# EAGLE design echofx (EAGLE 6.6.0)
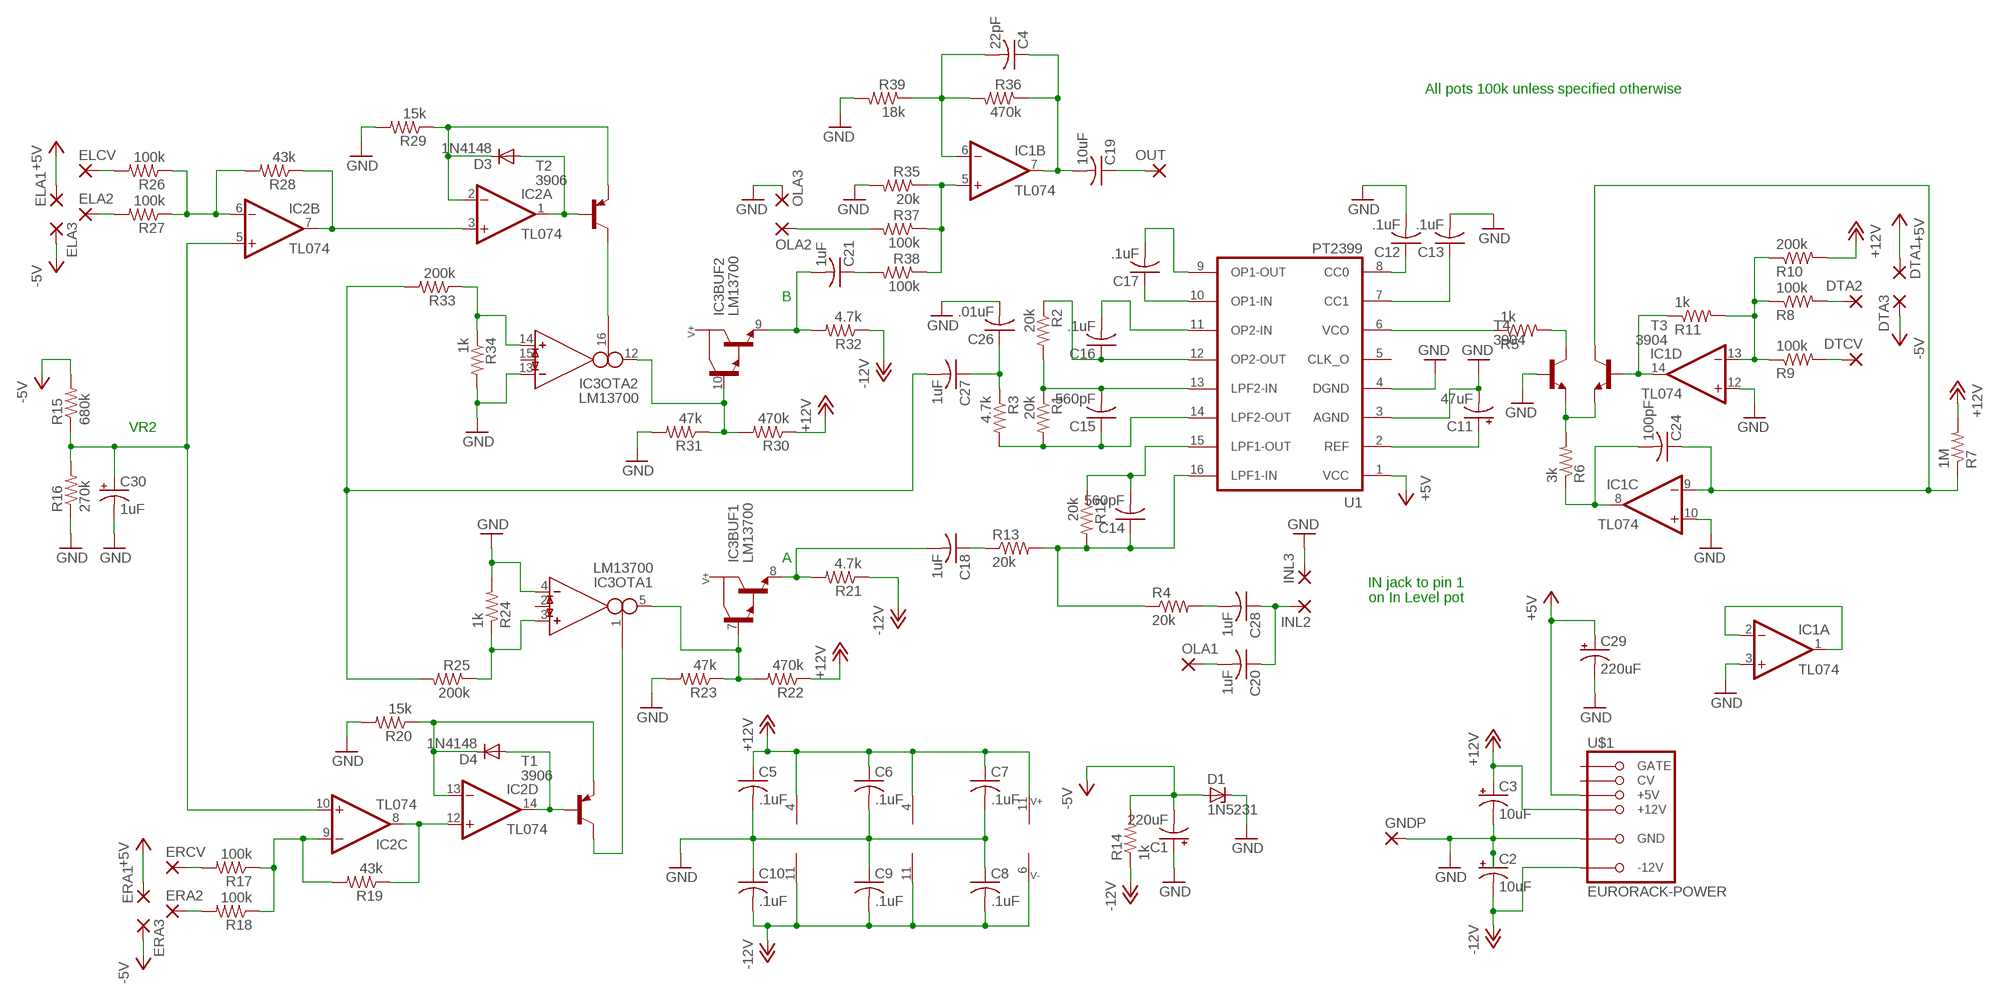
[diagram p0: schematic, sheet 1]

## Parts
C1  220uF  CPOL-USE2-5  [E2-5]
C2  10uF  CPOL-USE2-5  [E2-5]
C3  10uF  CPOL-USE2-5  [E2-5]
C4  22pF  C-US050-025X075  [C050-025X075]
C5  .1uF  C-US050-025X075  [C050-025X075]
C6  .1uF  C-US050-025X075  [C050-025X075]
C7  .1uF  C-US050-025X075  [C050-025X075]
C8  .1uF  C-US050-025X075  [C050-025X075]
C9  .1uF  C-US050-025X075  [C050-025X075]
C10  .1uF  C-US050-025X075  [C050-025X075]
C11  47uF  CPOL-USE2-5  [E2-5]
C12  .1uF  C-US050-025X075  [C050-025X075]
C13  .1uF  C-US050-025X075  [C050-025X075]
C14  560pF  C-US050-025X075  [C050-025X075]
C15  560pF  C-US050-025X075  [C050-025X075]
C16  .1uF  C-US050-025X075  [C050-025X075]
C17  .1uF  C-US050-025X075  [C050-025X075]
C18  1uF  C-US050-025X075  [C050-025X075]
C19  10uF  C-US050-025X075  [C050-025X075]
C20  1uF  C-US050-025X075  [C050-025X075]
C21  1uF  C-US050-025X075  [C050-025X075]
C24  100pF  C-US050-025X075  [C050-025X075]
C26  .01uF  C-US050-025X075  [C050-025X075]
C27  1uF  C-US050-025X075  [C050-025X075]
C28  1uF  C-US050-025X075  [C050-025X075]
C29  220uF  CPOL-USE2-5  [E2-5]
C30  1uF  CPOL-USE2-5  [E2-5]
D1  1N5231  ZENER-DIODEDO34-7  [DO34Z7]
D3  1N4148  1N4148DO35-7  [DO35-7]
D4  1N4148  1N4148DO35-7  [DO35-7]
DTA1  2,54/1,0  [2,54/1,0]
DTA2  2,54/1,0  [2,54/1,0]
DTA3  2,54/1,0  [2,54/1,0]
DTCV  2,54/1,0  [2,54/1,0]
ELA1  2,54/1,0  [2,54/1,0]
ELA2  2,54/1,0  [2,54/1,0]
ELA3  2,54/1,0  [2,54/1,0]
ELCV  2,54/1,0  [2,54/1,0]
ERA1  2,54/1,0  [2,54/1,0]
ERA2  2,54/1,0  [2,54/1,0]
ERA3  2,54/1,0  [2,54/1,0]
ERCV  2,54/1,0  [2,54/1,0]
GNDP  2,54/1,0  [2,54/1,0]
IC1  TL074  TL074-TOPP  [DIL14]
IC2  TL074  TL074-TOPP  [DIL14]
IC3  LM13700  LM13700N  [DIL16]
INL2  2,54/1,0  [2,54/1,0]
INL3  2,54/1,0  [2,54/1,0]
OLA1  2,54/1,0  [2,54/1,0]
OLA2  2,54/1,0  [2,54/1,0]
OLA3  2,54/1,0  [2,54/1,0]
OUT  2,54/1,0  [2,54/1,0]
R1  20k  R-US_0207/10  [0207/10]
R2  20k  R-US_0207/10  [0207/10]
R3  4.7k  R-US_0207/10  [0207/10]
R4  20k  R-US_0207/10  [0207/10]
R5  1k  R-US_0207/10  [0207/10]
R6  3k  R-US_0207/10  [0207/10]
R7  1M  R-US_0207/10  [0207/10]
R8  100k  R-US_0207/10  [0207/10]
R9  100k  R-US_0207/10  [0207/10]
R10  200k  R-US_0207/10  [0207/10]
R11  1k  R-US_0207/10  [0207/10]
R12  20k  R-US_0207/10  [0207/10]
R13  20k  R-US_0207/10  [0207/10]
R14  1k  R-US_0207/10  [0207/10]
R15  680k  R-US_0207/10  [0207/10]
R16  270k  R-US_0207/10  [0207/10]
R17  100k  R-US_0207/10  [0207/10]
R18  100k  R-US_0207/10  [0207/10]
R19  43k  R-US_0207/10  [0207/10]
R20  15k  R-US_0207/10  [0207/10]
R21  4.7k  R-US_0207/10  [0207/10]
R22  470k  R-US_0207/10  [0207/10]
R23  47k  R-US_0207/10  [0207/10]
R24  1k  R-US_0207/10  [0207/10]
R25  200k  R-US_0207/10  [0207/10]
R26  100k  R-US_0207/10  [0207/10]
R27  100k  R-US_0207/10  [0207/10]
R28  43k  R-US_0207/10  [0207/10]
R29  15k  R-US_0207/10  [0207/10]
R30  470k  R-US_0207/10  [0207/10]
R31  47k  R-US_0207/10  [0207/10]
R32  4.7k  R-US_0207/10  [0207/10]
R33  200k  R-US_0207/10  [0207/10]
R34  1k  R-US_0207/10  [0207/10]
R35  20k  R-US_0207/10  [0207/10]
R36  470k  R-US_0207/10  [0207/10]
R37  100k  R-US_0207/10  [0207/10]
R38  100k  R-US_0207/10  [0207/10]
R39  18k  R-US_0207/10  [0207/10]
T1  3906  2N3906-PNP-TO92-EBC  [TO92-EBC]
T2  3906  2N3906-PNP-TO92-EBC  [TO92-EBC]
T3  3904  2N3904-NPN-TO92-EBC  [TO92-EBC]
T4  3904  2N3904-NPN-TO92-EBC  [TO92-EBC]
U1  PT2399  [DIL16]
U$1  EURORACK-POWER  [PINSHRD_PTH_2X8]

## Nets
+5V: C29.+ DTA1.1(P) ELA1.1(P) ERA1.1(P) U1.1(VCC) U$1.+5V@1(+5V) U$1.+5V@2(+5V)
+12V: C3.+ C5.1 C6.1 C7.1 IC1.4(P:V+) IC2.4(P:V+) IC3.11 R7.2 R10.2 R22.1 R30.1 U$1.+12V@1(+12V) U$1.+12V@2(+12V)
-5V: C1.- D1.A DTA3.1(P) ELA3.1(P) ERA3.1(P) R14.2 R15.2
-12V: C2.- C8.2 C9.2 C10.2 IC1.11(P:V-) IC2.11(P:V-) IC3.6 R14.1 R21.1 R32.1 U$1.-12V@1(-12V) U$1.-12V@2(-12V)
GND: C1.+ C2.+ C3.- C5.2 C6.2 C7.2 C8.1 C9.1 C10.1 C11.- C12.2 C13.2 C26.2 C29.- C30.- D1.C GNDP.1(P) IC1.3(A:+IN) IC1.10(C:+IN) IC1.12(D:+IN) IC3.4(OTA1:IN_N) IC3.13(OTA2:IN_N) INL3.1(P) OLA3.1(P) R16.1 R20.2 R23.2 R24.2 R29.2 R31.2 R34.2 R35.2 R39.2 T4.B U1.3(AGND) U1.4(DGND) U$1.GND@1(GND) U$1.GND@2(GND) U$1.GND@3(GND) U$1.GND@4(GND) U$1.GND@5(GND) U$1.GND@6(GND)
N$1: C11.+ U1.2(REF)
N$2: IC1.14(D:OUT) R11.1 T3.B
N$3: C12.1 U1.8(CC0)
N$4: C13.1 U1.7(CC1)
N$5: C17.1 U1.10(OP1-IN)
N$6: C17.2 U1.9(OP1-OUT)
N$7: C16.2 U1.11(OP2-IN)
N$8: C16.1 R2.1 U1.12(OP2-OUT)
N$9: C15.2 R1.1 R2.2 U1.13(LPF2-IN)
N$10: C15.1 R1.2 R3.2 U1.14(LPF2-OUT)
N$11: C26.1 C27.1 R3.1
N$12: C20.1 C28.1 INL2.1(P)
N$13: C28.2 R4.2
N$14: R5.1 U1.6(VCO)
N$15: C24.1 IC1.9(C:-IN) R7.1 T3.C
N$16: C24.2 IC1.8(C:OUT) R6.1
N$17: R6.2 T3.E T4.E
N$18: R5.2 T4.C
N$19: DTA2.1(P) R8.2
N$20: DTCV.1(P) R9.2
N$21: IC1.13(D:-IN) R8.1 R9.1 R10.1 R11.2
N$22: C14.2 R12.1 U1.15(LPF1-OUT)
N$23: C14.1 R4.1 R12.2 R13.2 U1.16(LPF1-IN)
N$24: C18.1 R13.1
N$25: ERCV.1(P) R17.2
N$26: C27.2 R25.2 R33.2
N$27: ERA2.1(P) R18.2
N$28: IC2.9(C:-IN) R17.1 R18.1 R19.2
N$29: IC2.8(C:OUT) IC2.12(D:+IN) R19.1
N$30: D4.C IC2.13(D:-IN) R20.1 T1.E
N$31: D4.A IC2.14(D:OUT) T1.B
N$32: C18.2 IC3.8(BUF1:E) R21.2
N$33: IC3.1(OTA1:I_BIAS) T1.C
N$34: IC3.5(OTA1:OUT) IC3.7(BUF1:B) R22.2 R23.1
N$35: IC3.3(OTA1:IN_P) R24.1 R25.1
N$36: ELCV.1(P) R26.2
N$37: ELA2.1(P) R27.2
N$38: IC2.6(B:-IN) R26.1 R27.1 R28.2
N$39: IC2.3(A:+IN) IC2.7(B:OUT) R28.1
N$40: D3.C IC2.2(A:-IN) R29.1 T2.E
N$41: D3.A IC2.1(A:OUT) T2.B
N$42: IC3.16(OTA2:I_BIAS) T2.C
N$43: IC3.10(BUF2:B) IC3.12(OTA2:OUT) R30.2 R31.1
N$44: C21.2 IC3.9(BUF2:E) R32.2
N$45: IC3.14(OTA2:IN_P) R33.1 R34.1
N$46: IC1.5(B:+IN) R35.1 R37.1 R38.1
N$47: C30.+ IC2.5(B:+IN) IC2.10(C:+IN) R15.1 R16.2
N$48: C4.2 IC1.6(B:-IN) R36.2 R39.1
N$49: C4.1 C19.2 IC1.7(B:OUT) R36.1
N$50: C19.1 OUT.1(P)
N$51: OLA2.1(P) R37.2
N$52: C20.2 OLA1.1(P)
N$53: C21.1 R38.2
N$55: IC1.1(A:OUT) IC1.2(A:-IN)
Unconnected: IC3.2(OTA1:I_DIODE) IC3.15(OTA2:I_DIODE) U1.5(CLK_O) U$1.CV@1(CV) U$1.CV@2(CV) U$1.GATE@1(GATE) U$1.GATE@2(GATE)

## Notes on the sheet
- All pots 100k unless specified otherwise
- B
- VR2
- A
- IN jack to pin 1
  on In Level pot

## Library data of the parts
C1-C3 C11 C29 C30 = rcl:CPOL-US: POLARIZED CAPACITOR, American symbol
C4-C10 C12-C21 C24 C26-C28 = rcl:C-US: CAPACITOR, American symbol
D1 = diode:ZENER-DIODE: Z-Diode
D3 D4 = diode:1N4148: DIODE high speed (Philips)
DTA1-DTA3 DTCV ELA1-ELA3 ELCV ERA1-ERA3 ERCV GNDP INL2 INL3 OLA1-OLA3 OUT = wirepad:2,54/1,0: THROUGH-HOLE PAD
IC1 IC2 = mmoretti:TL074-TOP: OP AMP
IC3 = mmoretti:LM13700: Dual OTA with buffers
R1-R39 = rcl:R-US_: RESISTOR, American symbol
T1 T2 = transistor-neu-to92:*-PNP-: PNP Transistror
T3 T4 = transistor-neu-to92:*-NPN-: NPN Transistror
U1 = mmoretti:PT2399: Echo Processor IC
U$1 = mmoretti:EURORACK-POWER

## Board
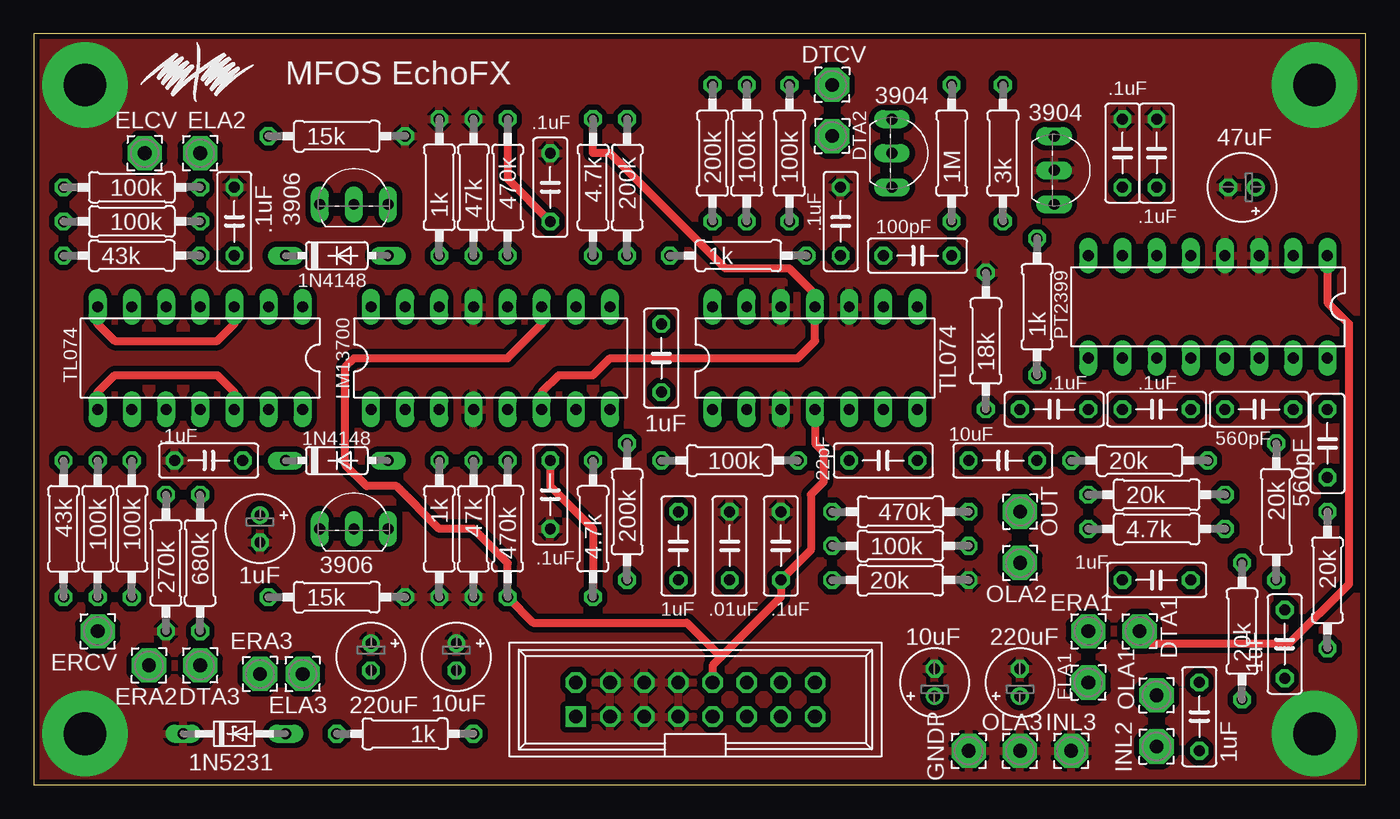
[diagram p1: board, top side]
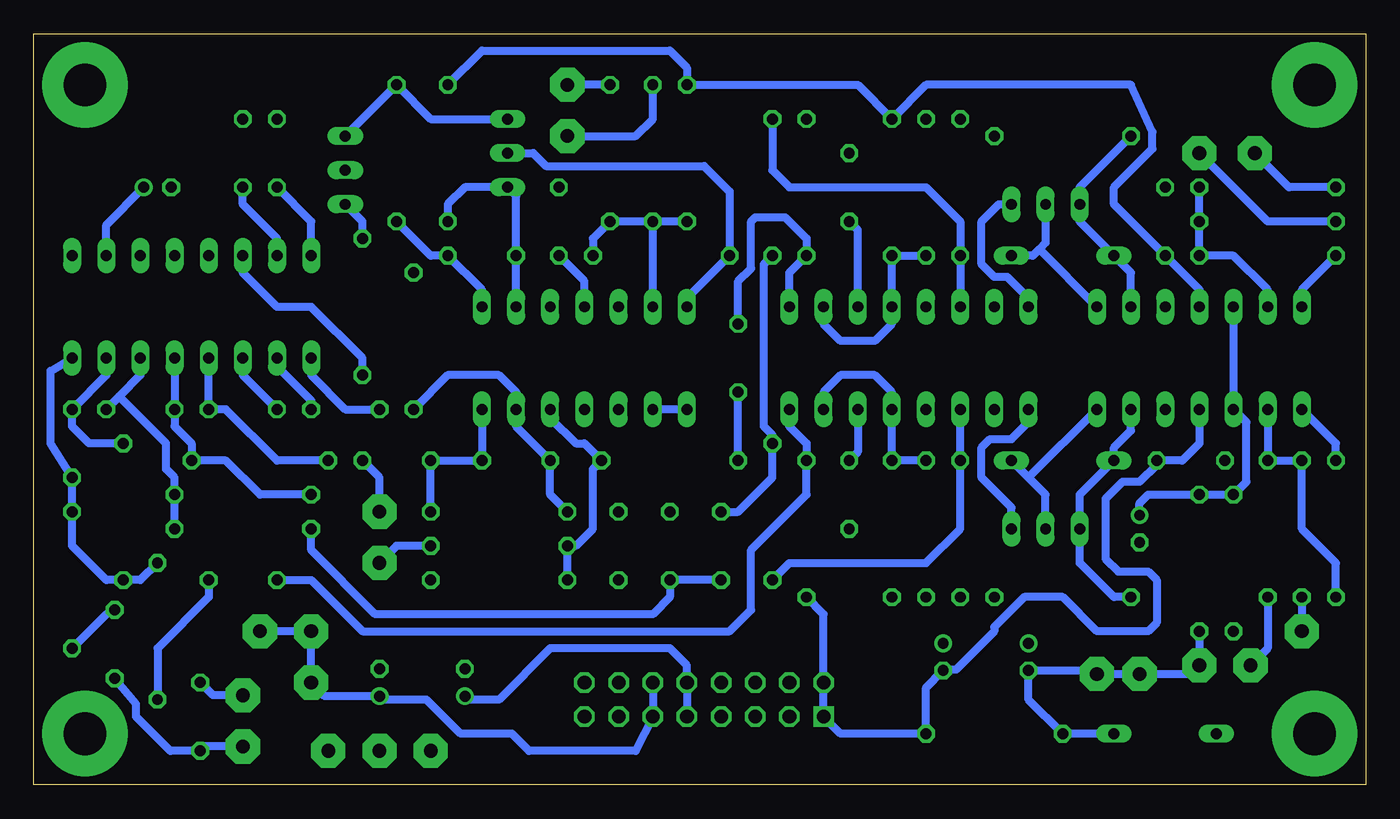
[diagram p2: board, bottom side, seen from below]

Size 99.06 x 55.88 mm. Coordinates in mm from the lower left corner, seen from the top.
Outline: 0,0 99.04,0 99.06,55.88 0,55.88 0,0
Copper layers (1*16): Top 0.035mm / dielectric 1.5mm / Bottom 0.035mm
Design rules "SeeedStudio_2layer_DRU_no_angle_20140221": minimum track width 6mil, minimum drill 12mil, track to track 6mil, track to pad 6mil, pad to pad 6mil, via to via 6mil, smd to smd 0mil, copper to edge 10mil, drill to drill 10mil, minimum pad ring 10mil, minimum via ring 6mil, stop-mask expansion 2mil, vias tented up to drill 100mil, thermal gap 10mil

### Footprints (pad centres in the part's own frame; a part is rotated, then mirrored left to right if it is on the bottom)
E2-5 = drill 0.813 pad 1.27: + -1.016,0 | drill 0.813 pad 1.27 octagon: - 1.016,0
C050-025X075 = drill 0.813 octagon: 1 -2.54,0; 2 2.54,0
DO34Z7 = drill 0.813 long: A 3.81,0; C -3.81,0
DO35-7 = drill 0.813 long: A 3.81,0; C -3.81,0
2,54/1,0 = drill 1.016 pad 2.54 octagon: 1 0,0
DIL14 = drill 0.813 long: 1 -7.62,-3.81; 2 -5.08,-3.81; 3 -2.54,-3.81; 4 0,-3.81; 5 2.54,-3.81; 6 5.08,-3.81; 7 7.62,-3.81; 8 7.62,3.81; 9 5.08,3.81; 10 2.54,3.81; 11 0,3.81; 12 -2.54,3.81; 13 -5.08,3.81; 14 -7.62,3.81
DIL16 = drill 0.813 long: 1 -8.89,-3.81; 2 -6.35,-3.81; 3 -3.81,-3.81; 4 -1.27,-3.81; 5 1.27,-3.81; 6 3.81,-3.81; 7 6.35,-3.81; 8 8.89,-3.81; 9 8.89,3.81; 10 6.35,3.81; 11 3.81,3.81; 12 1.27,3.81; 13 -1.27,3.81; 14 -3.81,3.81; 15 -6.35,3.81; 16 -8.89,3.81
0207/10 = drill 0.813 octagon: 1 -5.08,0; 2 5.08,0
TO92-EBC = drill 0.813 long: B 0,-1.27; C 2.54,-1.27; E -2.54,-1.27
PINSHRD_PTH_2X8 = drill 1.016 octagon: +5V@1 3.81,1.27; +5V@2 3.81,-1.27; +12V@1 1.27,1.27; +12V@2 1.27,-1.27; -12V@1 -8.89,1.27; CV@1 6.35,1.27; CV@2 6.35,-1.27; GATE@1 8.89,1.27; GATE@2 8.89,-1.27; GND@1 -6.35,1.27; GND@2 -6.35,-1.27; GND@3 -3.81,1.27; GND@4 -3.81,-1.27; GND@5 -1.27,1.27; GND@6 -1.27,-1.27 | drill 1.016 square: -12V@2 -8.89,-1.27

### Placement (x,y rotation side)
C1  25.08,9.53 270 top
C2  31.43,9.53 270 top
C3  66.99,7.62 90 top
C4  63.18,24.13 180 top
C5  55.56,17.78 90 top
C6  14.92,41.91 90 top
C7  38.42,44.45 90 top
C8  38.42,21.59 90 top
C9  13.02,24.13 0 top
C10  60.01,41.91 270 top
C11  89.85,44.45 180 top
C12  80.96,46.99 90 top
C13  83.5,46.99 90 top
C14  96.2,25.4 90 top
C15  91.12,27.94 180 top
C16  83.5,27.94 180 top
C17  75.88,27.94 180 top
C18  83.5,15.24 180 top
C19  72.07,24.13 180 top
C20  86.68,5.08 90 top
C21  46.67,31.75 90 top
C24  65.72,39.37 0 top
C26  51.75,17.78 90 top
C27  47.94,17.78 90 top
C28  93.03,10.48 90 top
C29  73.34,7.62 90 top
C30  16.83,19.05 270 top
D1  14.92,3.81 0 top
D3  22.54,39.37 0 top
D4  22.54,24.13 0 top
DTA1  82.23,11.43 270 top
DTA2  59.37,48.26 180 top
DTA3  12.38,8.89 270 top
DTCV  59.37,52.07 180 top
ELA1  78.42,7.62 270 top
ELA2  12.38,46.99 0 top
ELA3  20,8.26 270 top
ELCV  8.26,46.99 0 top
ERA1  78.42,11.43 270 top
ERA2  8.57,8.89 0 top
ERA3  16.83,8.26 270 top
ERCV  4.76,11.43 0 top
GNDP  69.53,2.54 0 top
IC1  58.1,31.75 0 top
IC2  12.38,31.75 180 top
IC3  33.97,31.75 0 top
INL2  83.5,2.86 90 top
INL3  77.15,2.54 0 top
OLA1  83.5,6.67 90 top
OLA2  73.34,16.51 270 top
OLA3  73.34,2.54 0 top
OUT  73.34,20.32 270 top
R1  83.5,21.59 0 top
R2  82.23,24.13 0 top
R3  83.5,19.05 0 top
R4  96.2,15.24 270 top
R5  74.61,35.56 90 top
R6  72.07,46.99 90 top
R7  68.26,46.99 90 top
R8  53.02,46.99 90 top
R9  56.2,46.99 90 top
R10  50.48,46.99 90 top
R11  52.39,39.37 0 top
R12  92.39,20.32 270 top
R13  89.85,11.43 90 top
R14  27.62,3.81 180 top
R15  12.38,16.51 270 top
R16  9.84,16.51 90 top
R17  4.76,19.05 270 top
R18  7.3,19.05 270 top
R19  2.22,19.05 270 top
R20  22.54,13.97 0 top
R21  41.59,19.05 90 top
R22  35.24,19.05 90 top
R23  32.7,19.05 270 top
R24  30.16,19.05 270 top
R25  44.13,20.32 90 top
R26  7.3,44.45 180 top
R27  7.3,41.91 180 top
R28  7.3,39.37 0 top
R29  22.54,48.26 0 top
R30  35.24,44.45 270 top
R31  32.7,44.45 90 top
R32  41.59,44.45 270 top
R33  44.13,44.45 270 top
R34  30.16,44.45 90 top
R35  64.45,15.24 0 top
R36  64.45,20.32 180 top
R37  64.45,17.78 0 top
R38  51.75,24.13 180 top
R39  70.8,33.02 90 top
T1  23.81,20.32 0 top
T2  23.81,44.45 0 top
T3  65.09,46.99 270 top
T4  77.15,45.72 270 top
U1  87.31,35.56 180 top
U$1  49.21,6.35 0 top

### Tracks (layer width: path | path; a pad name or v marks a point on that pad's centre or on a via)
+5V
  Top 0.61: U1.1 96.2,35.88 97.79,34.29 97.79,14.92 93.34,10.48 83.19,10.48 DTA1.1
  Bottom 0.61: U$1.+5V@1 U$1.+5V@2 54.29,2.54 62.23,2.54 63.5,3.81 67.31,3.81 69.85,6.35 73.09,6.35 C29.+ 77.41,6.6 ELA1.1 ERA1.1 DTA1.1
+12V
  Top 0.61: IC1.4 58.1,25.4 58.74,24.77 58.74,22.54 57.78,21.59 57.78,17.46 C5.1 55.56,13.97 51.12,9.53 | 51.12,9.53 50.48,8.89 U$1.+12V@1 | R30.1 35.24,45.09 C7.1 | IC3.11 37.78,34.29 35.24,31.75 23.81,31.75 23.18,31.11 23.18,23.81 24.77,22.23 26.99,22.23 30.16,19.05 32.7,19.05 35.24,16.51 R22.1 37.15,12.06 48.58,12.06 51.12,9.53
  Bottom 0.61: R7.2 65.72,54.61 51.75,54.61 50.48,53.34 R10.2 37.78,52.07 R30.1 32.7,52.07 17.46,52.07 15.88,48.58 15.88,47.31 18.73,44.45 18.73,43.18 C6.1 12.38,36.83 IC2.4 | IC3.11 37.78,41.27 C7.1 | U$1.+12V@2 U$1.+12V@1 50.48,8.89 51.75,10.16 60.64,10.16 64.45,6.35 66.74,6.35 C3.+
-5V
  Bottom 0.61: R15.2 DTA3.1 13.02,8.26 ERA3.1 ELA3.1 20.26,8.51 C1.- 25.08,6.35 R14.2 D1.A
-12V
  Top 0.61: R32.1 41.59,46.99 42.86,46.99 51.44,38.42 56.2,38.42 58.1,36.51 IC1.11 58.1,33.02 56.83,31.75 42.86,31.75 41.59,30.48 39.05,30.48 37.78,29.21 IC3.6 | C8.2 38.42,22.23 41.59,19.05 R21.1
  Bottom 0.61: IC2.11 12.38,25.4 13.65,24.13 C9.2 15.56,23.81 16.83,22.54 18.1,22.54 19.37,21.27 19.37,16.83 18.41,15.88 16.19,15.88 15.56,15.24 15.56,12.06 16.19,11.43 20,11.43 22.54,13.97 25.4,13.97 27.62,11.75 27.62,11.43 30.48,8.57 31.37,8.57 C2.- 32.7,7.24 R14.1 39.05,3.81 U$1.-12V@2 U$1.-12V@1 40.32,12.7 R21.1 | IC3.6 37.78,24.77 C8.2 | IC1.11 58.1,37.47 C10.2
GND  (via drill 3.17 pad 6.35)
  other vias: 3.81,52.07 3.81,3.81 95.25,3.81 95.25,52.07
  pour Top (isolate 0.406): 0,55.88 99.06,55.88 99.06,0 0,0
N$1
  Bottom 0.61: U1.2 93.66,41.66 C11.+
N$2
  Bottom 0.61: T3.B 61.91,46.99 60.96,46.04 49.21,46.04 47.31,44.13 R11.1 50.48,36.2 IC1.14
N$3
  Bottom 0.61: U1.8 78.42,41.91 C12.1
N$4
  Bottom 0.61: U1.7 80.96,40.64 83.5,43.18 C13.1
N$5
  Bottom 0.61: U1.10 80.96,31.11 78.42,28.57 C17.1
N$6
  Bottom 0.61: U1.9 78.42,30.48 75.88,27.94 C17.2
N$7
  Bottom 0.61: U1.11 83.5,30.48 C16.2
N$8
  Bottom 0.61: R2.1 80.96,24.13 84.77,27.94 C16.1 U1.12
N$9
  Bottom 0.61: U1.13 C15.2 88.58,26.67 87.31,25.4 R2.2 84.77,24.13 82.23,21.59 R1.1
N$10
  Bottom 0.61: U1.14 91.12,30.48 92.71,28.89 | 92.71,28.89 C15.1 | R3.2 R1.2 88.58,22.86 89.22,23.5 89.22,25.4 92.71,28.89
N$11
  Bottom 0.61: C27.1 C26.1 51.75,13.97 53.02,12.7 73.66,12.7 78.42,17.46 R3.1
N$12
  Bottom 0.61: INL2.1 86.36,2.86 C20.1 88.9,2.54 91.44,5.08 91.44,6.03 C28.1
N$13
  Bottom 0.61: C28.2 93.66,12.7 R4.2
N$14
  Bottom 0.61: R5.1 74.61,31.75 78.42,35.56 80.96,35.56 83.5,38.1 U1.6
N$15
  Bottom 0.61: IC1.9 C24.1 63.18,43.81 T3.C 66.99,44.45 68.26,43.18 R7.1
N$16
  Bottom 0.61: IC1.8 65.72,36.83 C24.2 69.53,39.37 R6.1
N$17
  Bottom 0.61: T4.E R6.2 69.53,49.53 T3.E
N$18
  Bottom 0.61: R5.2 74.61,41.91 T4.C
N$19
  Bottom 0.61: DTA2.1 54.29,48.26 53.02,49.53 R8.2
N$20
  Bottom 0.61: R9.2 DTCV.1
N$21
  Bottom 0.61: IC1.13 R8.1 | R10.1 R8.1 | R8.1 R9.1 57.47,40.64 R11.2
N$22
  Bottom 0.61: U1.15 93.66,30.48 C14.2 96.2,26.67 94.93,25.4 R12.1
N$23
  Bottom 0.61: R13.2 91.12,15.24 R12.2 93.66,15.24 96.2,17.78 R4.1 C14.1 97.79,25.4 97.79,30.8 U1.16
N$24
  Bottom 0.61: C18.1 86.04,13.97 89.85,10.16 R13.1
N$25
  Bottom 0.61: R17.2 ERCV.1
N$26
  Bottom 0.61: R33.2 44.77,38.73 44.77,26.67 44.13,26.04 R25.2 44.13,22.86 46.67,20.32 C27.2
N$27
  Bottom 0.61: R18.2 7.3,10.16 ERA2.1
N$28
  Bottom 0.61: IC2.9 R18.1 R17.1 4.76,19.05 2.22,16.51 R19.2
N$29
  Top 0.61: IC2.8 4.76,29.21 6.03,30.48 13.65,30.48 14.92,29.21 IC2.12
  Bottom 0.61: R19.1 2.22,25.4 IC2.8
N$30
  Bottom 0.61: R20.1 18.73,13.97 21.27,16.51 T1.E 21.27,21.59 D4.C 18.73,25.08 17.46,26.35 IC2.13
N$31
  Bottom 0.61: T1.B 23.81,21.59 25.08,22.86 | 25.08,22.86 D4.A | IC2.14 25.08,22.86
N$32
  Bottom 0.61: IC3.8 42.86,26.67 41.59,25.4 R21.2 41.59,21.59 45.72,17.46 45.72,13.02 47.31,11.43 74.61,11.43 78.42,15.24 C18.2
N$33
  Bottom 0.61: T1.C 26.35,20.64 28.57,22.86 28.57,25.08 27.94,25.72 26.35,25.72 25.08,26.99 IC3.1
N$34
  Bottom 0.61: R23.1 R22.2 IC3.5 35.24,29.21 36.51,30.48 39.05,30.48 40.32,29.21 IC3.7
N$35
  Bottom 0.61: IC3.3 R24.1 30.16,19.05 32.7,16.51 42.86,16.51 R25.1
N$36
  Bottom 0.61: R26.2 5.71,44.45 ELCV.1
N$37
  Bottom 0.61: R27.2 7.3,41.91 ELA2.1
N$38
  Bottom 0.61: IC2.6 7.3,36.83 9.84,39.37 R28.2 R27.1 R26.1
N$39
  Top 0.61: IC2.7 4.76,34.29 6.03,33.02 13.65,33.02 14.92,34.29 IC2.3
  Bottom 0.61: IC2.7 4.76,36.83 R28.1
N$40
  Bottom 0.61: IC2.2 17.46,38.1 D3.C 21.27,41.91 T2.E 21.27,44.45 R29.1
N$41
  Bottom 0.61: T2.B 23.81,40.32 24.29,39.85 | 24.29,39.85 24.77,39.37 D3.A | IC2.1 24.29,39.85
N$42
  Bottom 0.61: IC3.16 25.08,36.2 26.67,37.78 27.62,37.78 28.57,38.73 28.57,41.91 27.3,43.18 T2.C
N$43
  Bottom 0.61: IC3.10 40.32,34.29 39.05,33.02 36.51,33.02 35.24,34.29 IC3.12 R30.2 R31.1
N$44
  Bottom 0.61: C21.2 46.67,37.47 45.72,38.42 45.72,41.91 45.4,42.23 43.18,42.23 41.59,40.64 R32.2 42.86,38.1 IC3.9
N$45
  Bottom 0.61: R33.1 44.13,45.72 42.86,44.45 32.7,44.45 30.16,41.91 R34.1 IC3.14
N$46
  Bottom 0.61: R35.1 R37.1 58.74,17.78 57.47,19.05 57.47,23.5 R38.1 58.1,25.4 58.74,25.4 60.64,27.3 IC1.5
N$47
  Bottom 0.61: C30.+ 16.83,20.95 16.19,21.59 R15.1 R16.2 8.89,22.54 8.89,26.99 IC2.10 IC2.5
N$48
  Bottom 0.61: R39.1 68.26,30.48 64.45,30.48 63.18,29.21 IC1.6 63.18,26.67 C4.2 60.64,21.59 R36.2
N$49
  Bottom 0.61: IC1.7 C4.1 C19.2 R36.1
N$50
  Bottom 0.61: OUT.1 73.34,22.86 C19.1
N$51
  Bottom 0.61: R37.2 72.07,17.78 OLA2.1
N$52
  Bottom 0.61: OLA1.1 85.72,6.67 C20.2
N$53
  Bottom 0.61: R38.2 C21.1
N$55
  Bottom 0.61: IC1.1 IC1.2

### Text on the board
tPlace: MFOS EchoFX